# EAGLE design tia_LTC (EAGLE 9.2.2)
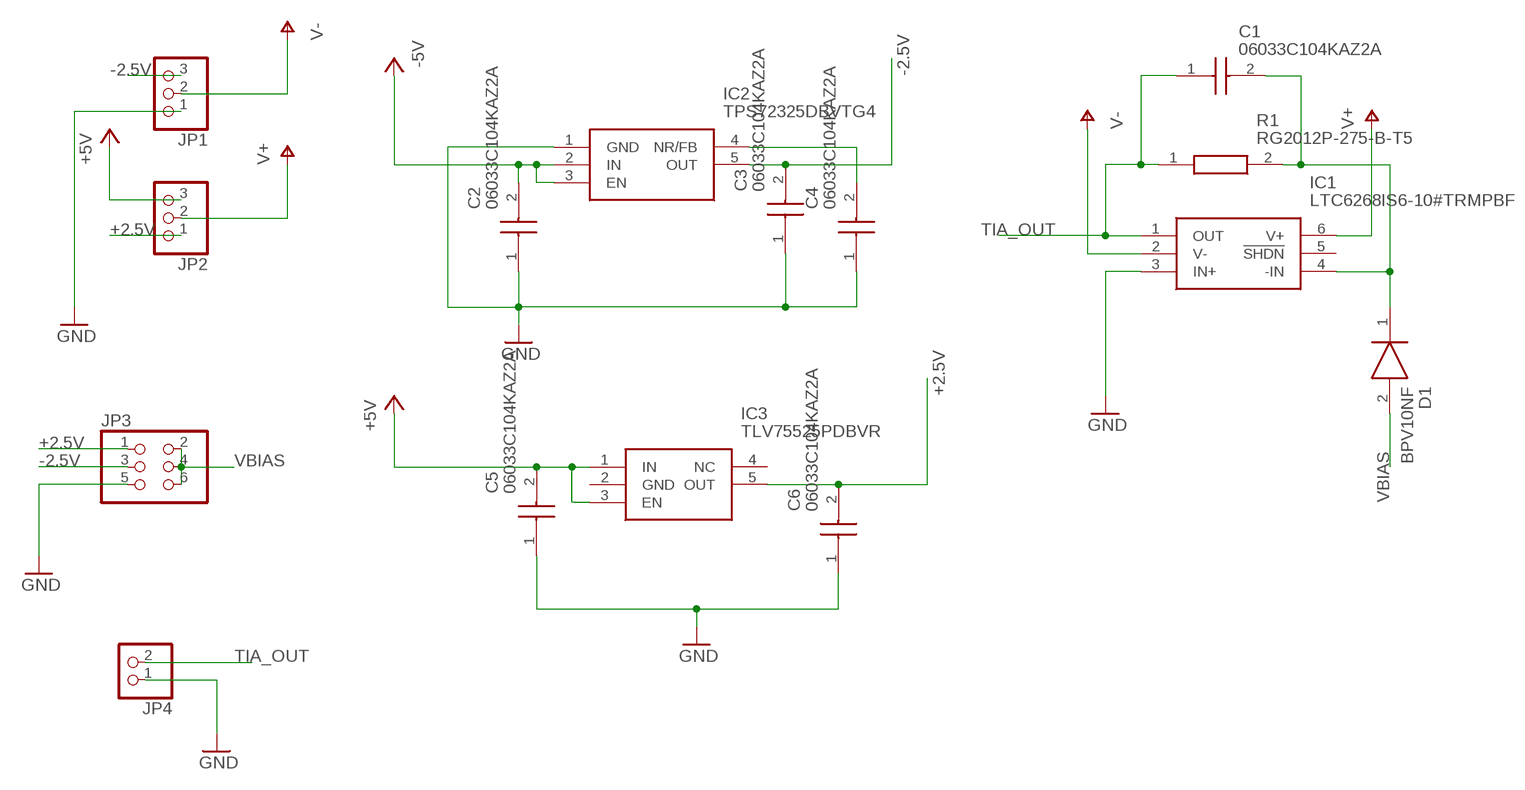
[diagram p0: schematic, sheet 1]

## Parts
C1  06033C104KAZ2A  [CAPC1608X90N]
C2  06033C104KAZ2A  [CAPC1608X90N]
C3  06033C104KAZ2A  [CAPC1608X90N]
C4  06033C104KAZ2A  [CAPC1608X90N]
C5  06033C104KAZ2A  [CAPC1608X90N]
C6  06033C104KAZ2A  [CAPC1608X90N]
D1  BPV10NF  [BPV10NF]
IC1  LTC6268IS6-10#TRMPBF  [SOT95P280X90-6N]
IC2  TPS72325DBVTG4  [SOT95P280X145-5N]
IC3  TLV75525PDBVR  [SOT95P280X145-5N]
JP1  PINHD-1X3  [1X03]
JP2  PINHD-1X3  [1X03]
JP3  PINHD-2X3  [2X03]
JP4  PINHD-1X2  [1X02]
R1  RG2012P-275-B-T5  [RESC2012X50N]

## Nets
+2.5V: C6.2 IC3.5(OUT) JP2.1 JP3.1
+5V: C5.2 IC3.1(IN) IC3.3(EN) JP2.3
-2.5V: C3.2 IC2.5(OUT) JP1.3 JP3.3
-5V: C2.2 IC2.2(IN) IC2.3(EN)
GND: C2.1 C3.1 C4.1 C5.1 C6.1 IC1.3(IN+) IC2.1(GND) JP1.1 JP3.5 JP4.1
N$1: C1.2 D1.1(K) IC1.4(-IN) R1.2
N$6: C4.2 IC2.4(NR/FB)
TIA_OUT: C1.1 IC1.1(OUT) JP4.2 R1.1
V+: IC1.6(V+) JP2.2
V-: IC1.2(V-) JP1.2
VBIAS: D1.2(A) JP3.2 JP3.4 JP3.6
Unconnected: IC1.5(!SHDN) IC3.4(NC)

## Power pins joined to a net without a drawn wire
GND: IC3.2(GND)

## Library data of the parts
C1-C6 = SamacSys_Parts:06033C104KAZ2A: AVX 0603 Standard 100nF Ceramic Multilayer Capacitor, 25 V dc, +125 Source: Datasheet <http://datasheets.avx.com/X7RDielectric.pdf>; DESCRIPTION: AVX 0603 Standard 100nF Ceramic Multilayer Capacitor, 25 V dc, +125; HEIGHT: 0.9mm; MANUFACTURER_NAME: AVX; MANUFACTURER_PART_NUMBER: 06033C104KAZ2A; MOUSER_PART_NUMBER: 581-06033C104KAZ2A; MOUSER_PRICE-STOCK: https://www.mouser.com/Search/Refine.aspx?Keyword=581-06033C104KAZ2A; RS_PART_NUMBER: 1356596; RS_PRICE-STOCK: https://uk.rs-online.com/web/p/products/1356596
D1 = SamacSys_Parts:BPV10NF: BPV10NF Vishay, IR Si Photodiode, 20 , Through Hole 5mm package Source: Datasheet <https://www.vishay.com/docs/81503/bpv10nf.pdf>; DESCRIPTION: BPV10NF Vishay, IR Si Photodiode, 20 , Through Hole 5mm package; HEIGHT: 8.9mm; MANUFACTURER_NAME: Vishay; MANUFACTURER_PART_NUMBER: BPV10NF; MOUSER_PART_NUMBER: 782-BPV10NF; MOUSER_PRICE-STOCK: https://www.mouser.com/Search/Refine.aspx?Keyword=782-BPV10NF; RS_PART_NUMBER: 6997607P; RS_PRICE-STOCK: http://uk.rs-online.com/web/p/products/6997607P
IC1 = SamacSys_Parts:LTC6268IS6-10#TRMPBF: LINEAR TECHNOLOGY - LTC6268IS6-10#TRMPBF - OP AMP, SINGLE, 4GHZ, 1.5KV/US, TSOT23-6 Source: Datasheet <http://www.linear.com/docs/46371>; DESCRIPTION: LINEAR TECHNOLOGY - LTC6268IS6-10#TRMPBF - OP AMP, SINGLE, 4GHZ, 1.5KV/US, TSOT23-6; HEIGHT: 0.9mm; MANUFACTURER_NAME: Linear Technology; MANUFACTURER_PART_NUMBER: LTC6268IS6-10#TRMPBF; MOUSER_PART_NUMBER: 584-C6268IS6-10TMPF; MOUSER_PRICE-STOCK: https://www.mouser.com/Search/Refine.aspx?Keyword=584-C6268IS6-10TMPF
IC2 = SamacSys_Parts:TPS72325DBVTG4: LDO Voltage Regulators 200mA Low Noise High-PSRR Source: Datasheet <http://www.ti.com/general/docs/suppproductinfo.tsp?distId=10&gotoUrl=http://www.ti.com/lit/gpn/tps723>; DESCRIPTION: LDO Voltage Regulators 200mA Low Noise High-PSRR; HEIGHT: 1.45mm; MANUFACTURER_NAME: Texas Instruments; MANUFACTURER_PART_NUMBER: TPS72325DBVTG4; MOUSER_PART_NUMBER: 595-TPS72325DBVTG4; MOUSER_PRICE-STOCK: https://www.mouser.com/Search/Refine.aspx?Keyword=595-TPS72325DBVTG4
IC3 = SamacSys_Parts:TLV75525PDBVR: 500-mA low-IQ small-size low-dropout (LDO) regulator Source: Datasheet <http://www.ti.com/lit/gpn/tlv755p>; DESCRIPTION: 500-mA low-IQ small-size low-dropout (LDO) regulator; HEIGHT: 1.45mm; MANUFACTURER_NAME: Texas Instruments; MANUFACTURER_PART_NUMBER: TLV75525PDBVR; MOUSER_PART_NUMBER: 595-TLV75525PDBVR; MOUSER_PRICE-STOCK: https://www.mouser.com/Search/Refine.aspx?Keyword=595-TLV75525PDBVR
JP1 JP2 = pinhead:PINHD-1X3: PIN HEADER
JP3 = pinhead:PINHD-2X3: PIN HEADER
JP4 = pinhead:PINHD-1X2: PIN HEADER
R1 = SamacSys_Parts:RG2012P-275-B-T5: Thin Film Resistors - SMD 1/4W 2.7M OHM .1% AEC Q200 Qualified Source: Datasheet <https://media.digikey.com/pdf/Data Sheets/Susumu PDFs/RG_RM_RGH_Oct2012.pdf>; DESCRIPTION: Thin Film Resistors - SMD 1/4W 2.7M OHM .1% AEC Q200 Qualified; HEIGHT: 0.5mm; MANUFACTURER_NAME: Susumu; MANUFACTURER_PART_NUMBER: RG2012P-275-B-T5; MOUSER_PART_NUMBER: 754-RG2012P-275B-T5; MOUSER_PRICE-STOCK: https://www.mouser.com/Search/Refine.aspx?Keyword=754-RG2012P-275B-T5

## Board
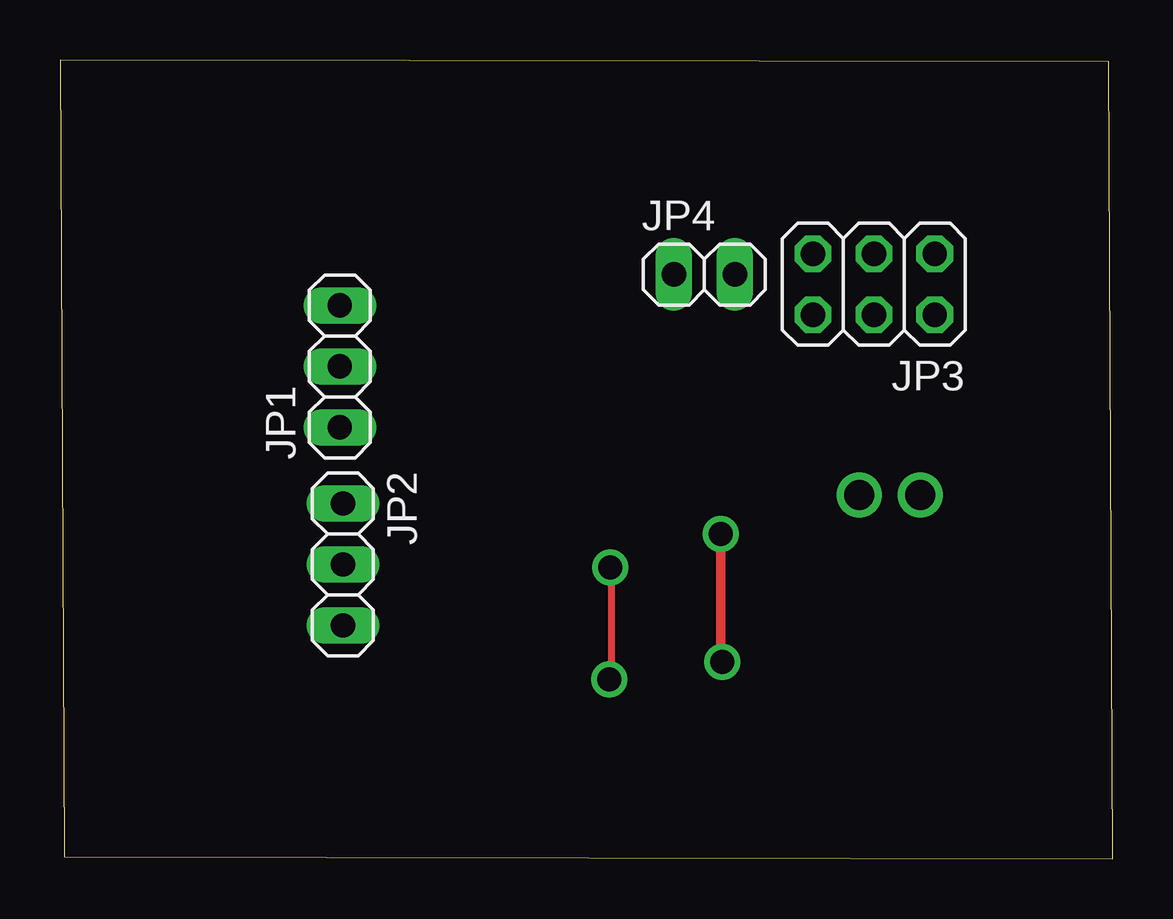
[diagram p1: board, top side]
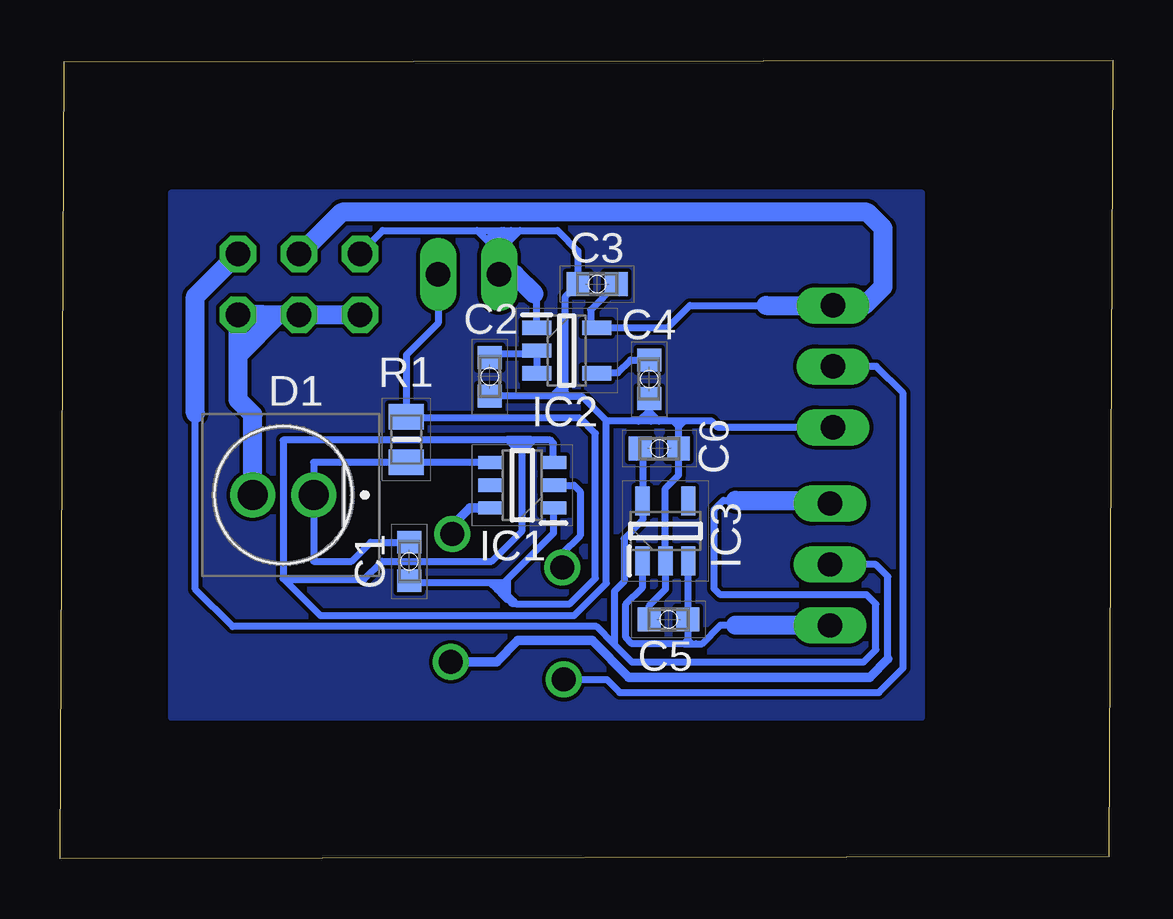
[diagram p2: board, bottom side, seen from below]

Size 43.87 x 33.3 mm. Coordinates in mm from the lower left corner, seen from the top.
Outline: 0.18,0.08 43.87,0 43.69,33.22 0,33.3 0.18,0.08
Copper layers (1*16): Top 0.035mm / dielectric 1.5mm / Bottom 0.035mm
Design rules "default": minimum track width 6mil, minimum drill 0.35mm, track to track 6mil, track to pad 6mil, pad to pad 6mil, via to via 6mil, smd to smd 6mil, copper to edge 40mil, drill to drill 6mil, minimum pad ring 10mil, minimum via ring 8mil, stop-mask expansion 4mil, vias tented up to drill 0mil, thermal gap 10mil

### Footprints (pad centres in the part's own frame; a part is rotated, then mirrored left to right if it is on the bottom)
CAPC1608X90N = smd 0.95 x 1: 1 -0.8,0; 2 0.8,0
BPV10NF = drill 1.25 pad 1.875: 1 -1.27,0; 2 1.27,0
SOT95P280X90-6N = smd 1.05 x 0.55: 1 -1.3,0.95; 2 -1.3,0; 3 -1.3,-0.95; 4 1.3,-0.95; 5 1.3,0; 6 1.3,0.95
SOT95P280X145-5N = smd 1.2 x 0.6: 1 -1.25,0.95; 2 -1.25,0; 3 -1.25,-0.95; 4 1.25,-0.95; 5 1.25,0.95
1X03 = drill 1.016 long: 1 -2.54,0; 2 0,0; 3 2.54,0
2X03 = drill 1.016 octagon: 1 -2.54,-1.27; 2 -2.54,1.27; 3 0,-1.27; 4 0,1.27; 5 2.54,-1.27; 6 2.54,1.27
1X02 = drill 1.016 long: 1 -1.27,0; 2 1.27,0
RESC2012X50N = smd 1.05 x 1.45: 1 -0.95,0; 2 0.95,0

### Placement (x,y rotation side)
C1  29.31,12.4 90 bottom
C2  25.96,20.09 90 bottom
C3  21.49,23.95 0 bottom
C4  19.33,19.99 90 bottom
C5  18.52,9.98 0 bottom
C6  18.9,17.09 180 bottom
D1  34.57,15.16 180 bottom
IC1  24.61,15.57 180 bottom
IC2  22.76,21.18 0 bottom
IC3  18.64,13.67 90 bottom
JP1  11.66,20.52 90 top
JP2  11.79,12.27 270 top
JP3  33.91,23.95 180 top
JP4  26.85,24.36 0 top
R1  29.44,17.48 270 bottom

### Tracks (layer width: path | path; a pad name or v marks a point on that pad's centre or on a via)
+2.5V
  Bottom 0.3: C6.2 19.59,16.99 IC3.5 19.59,14.11 20.37,13.34 20.37,11.56 20.78,11.15 20.78,8.94 | 20.78,8.94 20.04,8.2 10.39,8.2 9.88,8.71 9.88,10.62 10.26,11 16.36,11 16.61,11.25 16.61,14.55 16.23,14.94 15.72,14.94 | 20.78,8.94 21.51,9.68 36.68,9.68 38.23,11.23 38.23,18.57 38.23,18.85
  Bottom 0.8: JP2.1 11.91,14.94 15.72,14.94 | 38.23,18.57 38.23,23.44 JP3.1
+5V
  Bottom 0.3: IC3.3 17.69,10.01 C5.2 17.72,9.13 | 17.72,9.13 17.88,8.97 | IC3.1 19.59,11.32 20.29,10.62 20.29,9.22 20.04,8.97 17.88,8.97 | 17.88,8.97 17.55,8.97 | 15.72,9.73 16.36,9.73 17.12,8.97 17.37,8.97 17.55,8.97 | 17.72,9.13 17.55,8.97
  Bottom 0.8: JP2.3 15.72,9.73
-2.5V
  Bottom 0.3: C3.2 21.76,22.88 21.76,22.39 IC2.5 18.56,22.13 17.63,23.06 14.45,23.06
  Bottom 0.8: 14.45,23.06 JP1.3 10.36,23.06 9.58,23.85 9.58,26.29 10.24,26.95 32.13,26.95 33.86,25.22 JP3.3
-5V
  Bottom 0.3: IC2.3 IC2.2 24.14,21.06 25.79,21.06 C2.2
GND
  Bottom 0.3: IC1.3 23.31,17.32 23.47,17.48 24.1,17.48 | 24.23,17.48 24.49,17.48 | 24.49,17.48 24.74,17.48 | 24.74,17.48 25.25,17.48 25.22,17.45 | 25.22,17.45 34.57,17.45 34.57,11.68 34.52,11.63 | 24.61,17.35 24.61,13.67 25.88,12.4 30.45,12.4 31.21,11.63 34.52,11.63 | 24.49,17.22 24.49,17.48 | 24.49,17.22 24.61,17.35 | 24.61,17.35 24.74,17.48 | 24.49,17.22 24.23,17.48 | 24.23,17.48 24.1,17.48 | 24.49,17.22 24.36,17.22 24.1,17.48 | 24.49,17.22 24.99,17.22 25.22,17.45 | 24.13,22.26 IC2.1 24.01,23.45 24.12,23.56 24.84,24.28 | 25.64,19.61 C2.1 23.36,19.29 | C5.1 19.32,10.55 18.64,11.23 IC3.2 18.64,15.44 18.1,15.99 C6.1 18.1,18.01 | 18.1,18.01 18.1,18.24 | 18.1,18.24 18.33,18.24 | 18.33,18.24 18.92,18.24 | 18.92,18.24 19.25,18.24 | 19.25,18.24 19.76,18.24 | 19.76,18.24 21.08,18.24 | 21.08,18.24 21.11,18.24 21.11,11.48 22.45,10.13 33.02,10.13 34.52,11.63 | 17.87,18.24 16.71,18.24 16.46,17.98 JP1.1 | 17.87,18.24 18.1,18.24 | 18.1,18.01 17.87,18.24 | 18.1,18.01 18.33,18.24 | 21.08,18.24 22.11,19.27 22.64,19.27 | 22.64,19.27 23.01,19.27 | 23.01,19.27 23.38,19.27 23.36,19.29 | 19.33,18.64 C4.1 19.33,18.67 19.76,18.24 | 19.33,18.64 19.33,18.31 19.25,18.24 | 19.33,18.64 18.92,18.24 | 22.83,19.46 22.83,23.41 C3.1 22.29,25.34 23.14,26.19 24.71,26.19 | 23.01,19.63 23.01,19.27 | 23.01,19.63 22.83,19.46 | 22.83,19.46 22.64,19.27 | 23.01,19.63 23.36,19.29 | JP3.5 31.37,25.25 30.43,26.19 26.49,26.19 | 26.49,26.19 25.48,26.19 25.5,26.16 | 25.5,26.16 25.4,26.16 | 25.07,26.19 25.37,26.19 25.4,26.16 | 25.07,26.19 24.71,26.19 | 25.6,25.3 25.51,25.39 25.13,25.77 | 25.13,25.77 24.71,26.19 | 25.58,25.27 25.6,25.3 | 25.6,25.3 26.1,25.79 | 26.1,25.79 26.49,26.19
  Bottom 0.3: 25.58,25.98 25.58,26.09 | 25.58,26.09 25.5,26.16 | 26.1,25.79 25.81,26.09 25.58,26.09 | 25.58,25.78 25.58,25.98 | 26.1,25.79 25.59,25.79 25.58,25.78 | 25.58,25.98 25.4,26.16 | 25.4,26.16 25.4,26.04 25.13,25.77 | 25.07,26.19 25.48,25.78 25.58,25.78
  Bottom 0.8: 25.51,25.39 25.58,25.32 JP4.1 24.92,24.36 24.12,23.56
  cutout Bottom: 24.61,17.35 24.61,13.67 25.88,12.4 30.45,12.4 31.22,11.63 34.52,11.63 34.52,17.48 24.74,17.48
N$1
  Bottom 0.3: IC1.4 R1.2 33.3,16.53 D1.1 33.3,12.4 31.72,12.4 30.92,13.2 C1.2
N$6
  Bottom 0.3: IC2.4 21.48,20.26 20.62,20.26 20.09,20.79 C4.2
OUTER
  pour Bottom (isolate 0.003): 7.98,27.76 7.98,5.89 39.22,5.89 39.22,27.76
TIA_OUT
  Bottom 0.3: 29.27,11.63 C1.1 29.22,11.51 25.94,11.51 | 25.37,11.51 25.94,11.51 | IC1.1 23.31,13.57 25.23,11.65 | 25.23,11.65 25.37,11.51 | 24.96,10.73 25.12,10.73 | 25.37,10.94 25.66,11.22 | 25.66,11.22 25.94,11.51 | 25.37,11.51 25.37,11.15 | 25.37,11.15 25.37,10.94 | 25.37,10.94 25.23,10.8 25.23,10.85 | 25.66,11.22 25.37,11.51 | 25.23,11.65 25.23,10.85 | 25.23,10.85 25.12,10.73 | 25.37,11.15 24.96,10.73 | 24.96,10.73 24.86,10.63 | 24.86,10.63 22.62,10.63 21.56,11.69 21.56,17.73 22.2,18.36 29.38,18.36 R1.1 29.44,21.01 28.12,22.33 JP4.2 | 24.86,10.63 25.02,10.63 25.12,10.73
V+  (via drill 1)
  Top 0.4: v27.53,13.54 27.53,8.26 v27.58,8.2
  Bottom 0.3: 9.37,8.33 9.37,11.76 9.88,12.27 JP2.2
  Bottom 0.4: IC1.6 26.81,14.62 27.53,13.89 v27.53,13.54 | v27.58,8.2 25.68,8.2 24.79,9.09 21.69,9.09 20.17,7.57 10.13,7.57 9.37,8.33
V-  (via drill 1)
  Top 0.3: v22.94,12.14 22.96,12.12 22.96,7.54 v22.89,7.47
  Bottom 0.3: IC1.2 22.45,15.57 22.2,15.32 22.2,13.46 22.94,12.73 v22.94,12.14 | v22.89,7.47 21.08,7.47 20.55,6.93 9.75,6.93 8.74,7.95 8.74,19.41 9.86,20.52 JP1.2
VBIAS
  Bottom 0.8: D1.2 35.84,18.52 36.45,19.13 36.45,21.01 | 34.77,22.68 35.38,22.68 JP3.2 36.45,21.01 | JP3.6 JP3.4 34.34,22.68 34.77,22.68 | 36.45,21.01 34.77,22.68